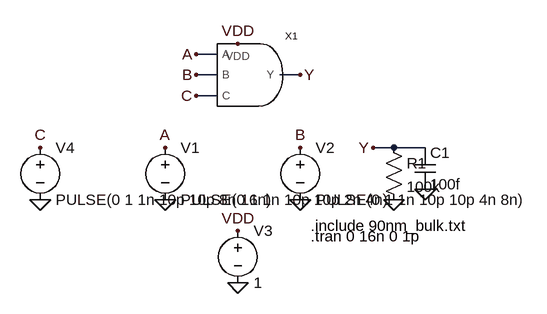
[diagram p0: schematic test.asc]
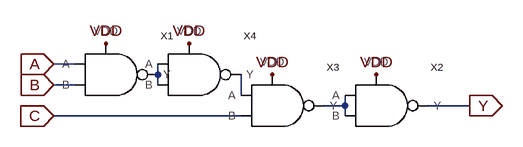
[diagram p1: sub-circuit and3.asc]
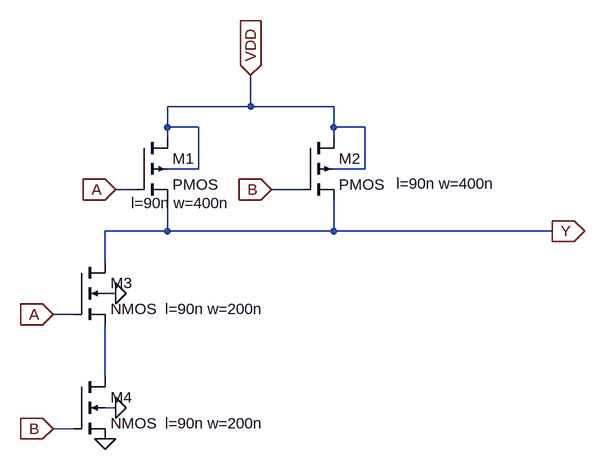
[diagram p2: sub-circuit nand.asc]
test.asc, the LTspice schematic file:
Version 4
SHEET 1 880 680
WIRE 64 64 32 64
WIRE 64 96 32 96
WIRE 192 96 160 96
WIRE 64 128 32 128
WIRE 336 208 304 208
WIRE 384 208 336 208
FLAG -16 288 0
FLAG 192 288 0
FLAG -16 208 A
FLAG 192 208 B
FLAG 304 208 Y
FLAG 336 288 0
FLAG 384 272 0
FLAG 96 336 VDD
FLAG 96 416 0
FLAG 96 48 VDD
FLAG 32 64 A
FLAG 32 96 B
FLAG 32 128 C
FLAG 192 96 Y
FLAG -208 288 0
FLAG -208 208 C
SYMBOL voltage -16 192 R0
WINDOW 123 0 0 Left 0
WINDOW 39 0 0 Left 0
SYMATTR InstName V1
SYMATTR Value PULSE(0 1 1n 10p 10p 2n 4n)
SYMBOL voltage 192 192 R0
WINDOW 123 0 0 Left 0
WINDOW 39 0 0 Left 0
SYMATTR InstName V2
SYMATTR Value PULSE(0 1 1n 10p 10p 4n 8n)
SYMBOL res 320 192 R0
SYMATTR InstName R1
SYMATTR Value 100k
SYMBOL cap 368 208 R0
SYMATTR InstName C1
SYMATTR Value 100f
SYMBOL voltage 96 320 R0
WINDOW 123 0 0 Left 0
WINDOW 39 0 0 Left 0
SYMATTR InstName V3
SYMATTR Value 1
SYMBOL and3 96 96 R0
SYMATTR InstName X1
SYMBOL voltage -208 192 R0
WINDOW 123 0 0 Left 0
WINDOW 39 0 0 Left 0
SYMATTR InstName V4
SYMATTR Value PULSE(0 1 1n 10p 10p 8n 16n)
TEXT 208 328 Left 2 !.include 90nm_bulk.txt
TEXT 208 344 Left 2 !.tran 0 16n 0 1p

and3.asc, the sub-circuit schematic file:
Version 4
SHEET 1 880 680
WIRE 144 144 112 144
WIRE 272 160 272 144
WIRE 144 176 112 176
WIRE 272 176 272 160
WIRE 400 192 400 160
WIRE 560 208 560 192
WIRE 560 208 528 208
WIRE 752 208 688 208
WIRE 400 224 112 224
WIRE 560 224 560 208
FLAG 112 144 A
IOPIN 112 144 In
FLAG 192 112 VDD
FLAG 448 160 VDD
FLAG 320 112 VDD
FLAG 112 176 B
IOPIN 112 176 In
FLAG 112 224 C
IOPIN 112 224 In
FLAG 608 160 VDD
FLAG 752 208 Y
IOPIN 752 208 Out
SYMBOL nand 192 160 R0
SYMATTR InstName X1
SYMBOL nand 448 208 R0
SYMATTR InstName X3
SYMBOL nand 320 160 R0
SYMATTR InstName X4
SYMBOL nand 608 208 R0
SYMATTR InstName X2

nand.asc, the sub-circuit schematic file:
Version 4
SHEET 1 1436 680
WIRE 896 -896 896 -944
WIRE 896 -896 768 -896
WIRE 1024 -896 896 -896
WIRE 768 -864 768 -896
WIRE 816 -864 768 -864
WIRE 1024 -864 1024 -896
WIRE 1072 -864 1024 -864
WIRE 768 -848 768 -864
WIRE 1024 -848 1024 -864
WIRE 816 -800 816 -864
WIRE 816 -800 768 -800
WIRE 1072 -800 1072 -864
WIRE 1072 -800 1024 -800
WIRE 720 -768 688 -768
WIRE 976 -768 928 -768
WIRE 768 -704 768 -752
WIRE 768 -704 672 -704
WIRE 1024 -704 1024 -752
WIRE 1024 -704 768 -704
WIRE 1360 -704 1024 -704
WIRE 672 -656 672 -704
WIRE 688 -608 672 -608
WIRE 624 -576 592 -576
WIRE 672 -480 672 -560
WIRE 688 -432 672 -432
WIRE 624 -400 592 -400
FLAG 688 -768 A
IOPIN 688 -768 In
FLAG 592 -576 A
IOPIN 592 -576 In
FLAG 1360 -704 Y
IOPIN 1360 -704 Out
FLAG 896 -944 VDD
IOPIN 896 -944 In
FLAG 928 -768 B
IOPIN 928 -768 In
FLAG 592 -400 B
IOPIN 592 -400 In
FLAG 688 -608 0
FLAG 688 -432 0
FLAG 672 -384 0
SYMBOL pmos4 720 -848 R0
WINDOW 123 -8 101 Left 2
SYMATTR InstName M1
SYMATTR Value2 l=90n w=400n
SYMBOL pmos4 976 -848 R0
WINDOW 123 144 71 Left 2
SYMATTR InstName M2
SYMATTR Value2 l=90n w=400n
SYMBOL nmos4 624 -656 R0
WINDOW 123 140 72 Left 2
SYMATTR InstName M3
SYMATTR Value2 l=90n w=200n
SYMBOL nmos4 624 -480 R0
WINDOW 123 140 72 Left 2
SYMATTR InstName M4
SYMATTR Value2 l=90n w=200n

The netlist it stands for:
* test.asc
V1 A 0 PULSE(0 1 1n 10p 10p 2n 4n)
V2 B 0 PULSE(0 1 1n 10p 10p 4n 8n)
R1 Y 0 100k
C1 Y 0 100f
V3 VDD 0 1
XX1 A B C VDD Y and3
V4 C 0 PULSE(0 1 1n 10p 10p 8n 16n)

* block symbol definitions
.subckt and3 A B C VDD Y
XX1 A B VDD N001 nand
XX3 N002 C VDD N003 nand
XX4 N001 N001 VDD N002 nand
XX2 N003 N003 VDD Y nand
.ends and3

.subckt nand A B VDD Y
M1 VDD A Y VDD PMOS l=90n w=400n
M2 VDD B Y VDD PMOS l=90n w=400n
M3 Y A N001 0 NMOS l=90n w=200n
M4 N001 B 0 0 NMOS l=90n w=200n
.ends nand

.model NMOS NMOS
.model PMOS PMOS
.lib standard.mos
.include 90nm_bulk.txt
.tran 0 16n 0 1p
.backanno
.end